# Altium schematic sheet power_PWR.schdoc: power_PWR.SchDoc
size A4; Organization: Badgerloop; Address1: 133 Engineering Research; Address2: Building; Address3: Madison, WI 53715; DocumentNumber: 1; Revision: A; SheetNumber: 1; SheetTotal: 2
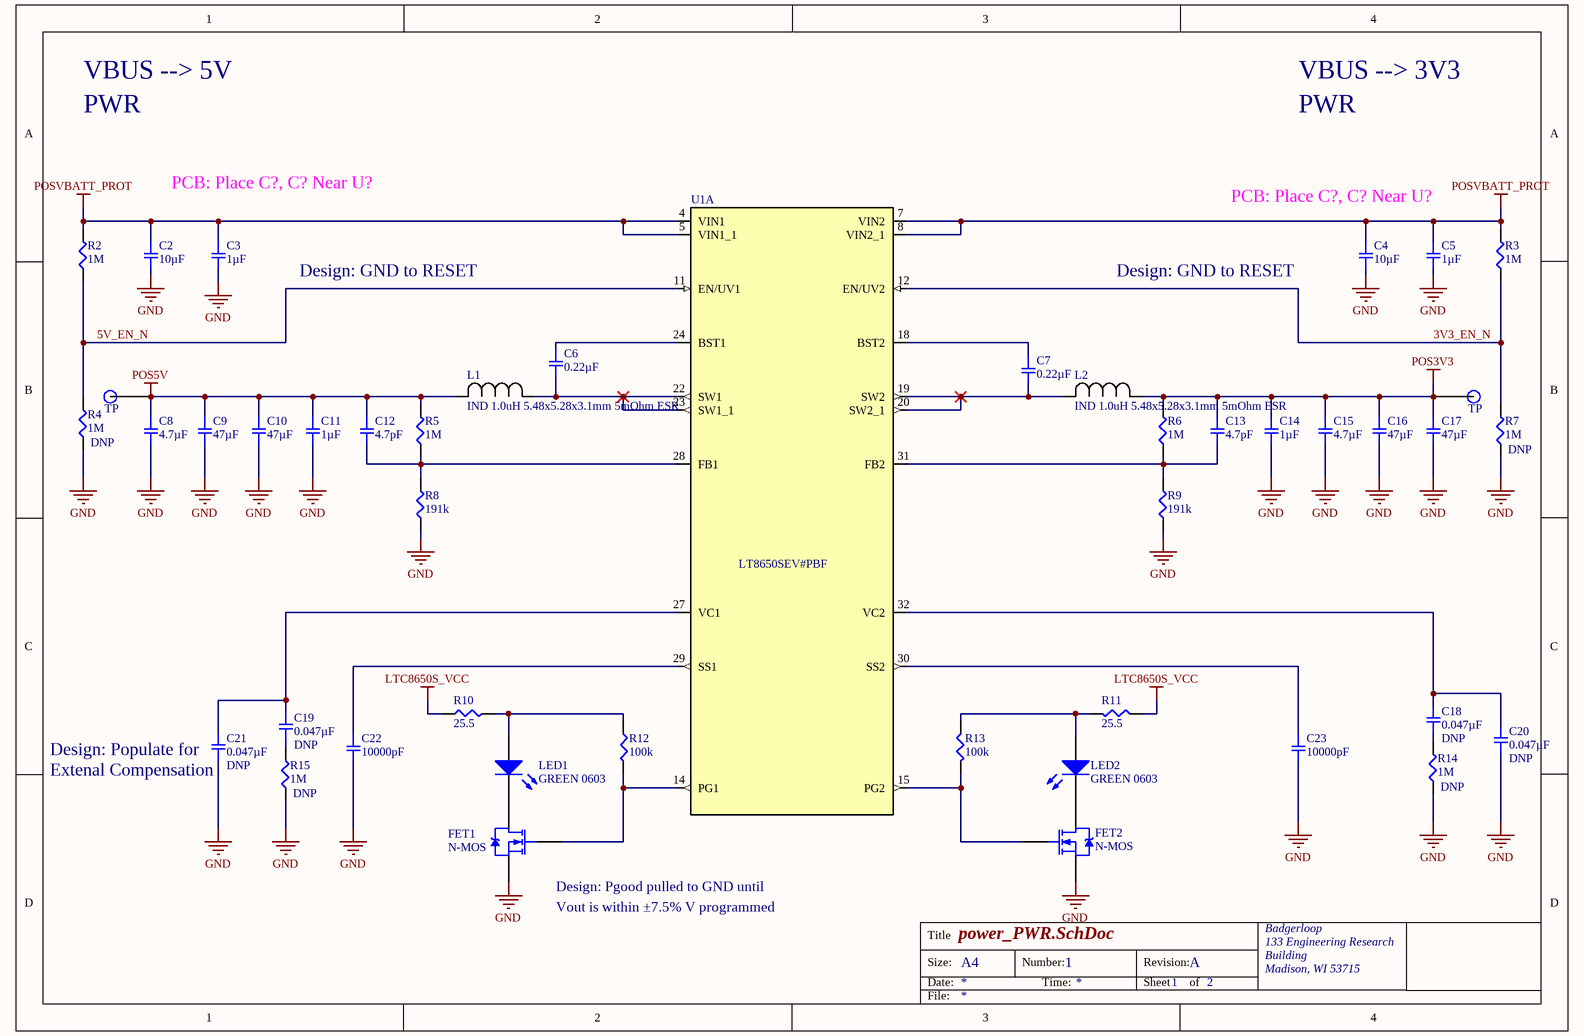
[diagram p0: power_PWR.schdoc]

## Parts
C2  10µF  [SMD-1206C]
C3  1µF  [SMD-0805C]
C4  10µF  [SMD-1206C]
C5  1µF  [SMD-0805C]
C6  0.22µF  [SMD-0603C]
C7  0.22µF  [SMD-0603C]
C8  4.7µF  [SMD-0603C]
C9  47µF  [SMD-1206C]
C10  47µF  [SMD-1206C]
C11  1µF  [SMD-0603C]
C12  4.7pF  [SMD-0603C]
C13  4.7pF  [SMD-0603C]
C14  1µF  [SMD-0603C]
C15  4.7µF  [SMD-0603C]
C16  47µF  [SMD-1206C]
C17  47µF  [SMD-1206C]
C18  0.047µF  Do Not Populate: DNP  [SMD-0402C]
C19  0.047µF  Do Not Populate: DNP  [SMD-0402C]
C20  0.047µF  Do Not Populate: DNP  [SMD-0402C]
C21  0.047µF  Do Not Populate: DNP  [SMD-0402C]
C22  10000pF  [SMD-0603C]
C23  10000pF  [SMD-0603C]
FET1  N-MOS  [SOT95P240X110-3N]
FET2  N-MOS  [SOT95P240X110-3N]
L1  IND 1.0uH 5.48x5.28x3.1mm 5mOhm ESR  [INDC5649X31N]
L2  IND 1.0uH 5.48x5.28x3.1mm 5mOhm ESR  [INDC5649X31N]
LED1  GREEN 0603  [LED 0603 GREEN]
LED2  GREEN 0603  [LED 0603 GREEN]
R2  1M  [SMD-0402-RES]
R3  1M  [SMD-0402-RES]
R4  1M  Do Not Populate: DNP  [SMD-0402-RES]
R5  1M  [SMD-0402-RES]
R6  1M  [SMD-0402-RES]
R7  1M  Do Not Populate: DNP  [SMD-0402-RES]
R8  191k  [SMD-0402-RES]
R9  191k  [SMD-0402-RES]
R10  25.5  [SMD-0805-RES]
R11  25.5  [SMD-0805-RES]
R12  100k  [SMD-0402-RES]
R13  100k  [SMD-0402-RES]
R14  1M  Do Not Populate: DNP  [SMD-0402-RES]
R15  1M  Do Not Populate: DNP  [SMD-0402-RES]
TP7  TP  [Test Point]
TP8  TP  [Test Point]
U1  LT8650SEV#PBF  [QFN50P600X400X103-32N240X440]  (part A of 2)

## Nets
GND: C2.2 C3.2 C4.2 C5.2 C8.2 C9.2 C10.2 C11.2 C14.2 C15.2 C16.2 C17.2 C20.1 C21.1 C22.2 C23.2 FET1.3(S) FET2.3(S) R4.1 R7.1 R8.1 R9.1 R14.1 R15.1
LTC8650S_VCC: R10.1 R11.1
POS3V3: C13.1 C14.1 C15.1 C16.1 C17.1 L2.1 R6.2 TP8.1
POS5V: C8.1 C9.1 C10.1 C11.1 C12.1 L1.2 R5.2 TP7.1
POSVBATT_PROT: C2.1 C3.1 C4.1 C5.1 R2.2 R3.2 U1.4(VIN1) U1.5(VIN1_1) U1.7(VIN2) U1.8(VIN2_1)
3V3_EN_N: R3.1 R7.2 U1.12(EN/UV2)
5V_EN_N: R2.1 R4.2 U1.11(EN/UV1)
NetC6_1: C6.1 U1.24(BST1)
NetC6_2: C6.2 L1.1 U1.22(SW1) U1.23(SW1_1)
NetC7_1: C7.1 U1.18(BST2)
NetC7_2: C7.2 L2.2 U1.19(SW2) U1.20(SW2_1)
NetC12_2: C12.2 R5.1 R8.2 U1.28(FB1)
NetC13_2: C13.2 R6.1 R9.2 U1.31(FB2)
NetC18_1: C18.1 R14.2
NetC18_2: C18.2 C20.2 U1.32(VC2)
NetC19_1: C19.1 R15.2
NetC19_2: C19.2 C21.2 U1.27(VC1)
NetC22_1: C22.1 U1.29(SS1)
NetC23_1: C23.1 U1.30(SS2)
NetFET1_1: FET1.1(G) R12.2 U1.14(PG1)
NetFET1_2: FET1.2(D) LED1.2(K)
NetFET2_1: FET2.1(G) R13.2 U1.15(PG2)
NetFET2_2: FET2.2(D) LED2.2(K)
NetLED1_1: LED1.1(A) R10.2 R12.1
NetLED2_1: LED2.1(A) R11.2 R13.1

## Notes on the sheet
- VBUS --> 5V
- PWR
- VBUS --> 3V3
- PCB: Place C?, C? Near U?
- Design: GND to RESET
- (near C21) Design: Populate for
- (near C21) Extenal Compensation
- (near FET1) Design: Pgood pulled to GND until
- (near FET1) Vout is within ±7.5% V programmed
- Title
- Size:
- Date:
- A4
- Number:
- Time:
- Revision:
- Sheet
- of
- File:

## Library data of the parts
C2 C4 = GRM31CR61H106KA12L: CAP CER 10UF 50V X5R 1206; Manufacturer: Murata Electronics North America; Factory Stock: 0; Unit Price (USD): 0.65; Minimum Quantity: 1; Tolerance: ±10%; Datasheets: http://www.murata.com/~/media/webrenewal/support/library/catalog/products/capacitor/mlcc/c02e.pdf; Image: //media.digikey.com/Renders/Murata%20Renders/GR331BD72E473KW01L.jpg; Digi-Key Part Number: 490-5961-1-ND; Part Number: GRM31CR61H106KA12L; Quantity Available: 86736; @ qty: 0; Packaging: Cut Tape (CT); Series: GRM; Part Status: Active; Value: 10µF; Voltage: 50V; Temperature Coefficient: X5R; Operating Temperature: -55°C ~ 85°C; Features: -; Ratings: -; Applications: General Purpose; Mounting Type: Surface Mount, MLCC; Package / Case: 1206 (3216 Metric); Size / Dimension: 0.126" L x 0.063" W (3.20mm x 1.60mm); Height - Seated (Max): -; Thickness (Max): 0.071" (1.80mm); Lead Spacing: -; Lead Style: -
C3 C5 = GCJ21BR71H105KA01L: CAP CER 1UF 50V X7R 0805; Manufacturer: Murata Electronics North America; Factory Stock: 0; Unit Price (USD): 0.33; Minimum Quantity: 1; Tolerance: ±10%; Datasheets: http://www.murata.com/~/media/webrenewal/support/library/catalog/products/capacitor/mlcc/c03e.ashx; Image: //media.digikey.com/Renders/Murata%20Renders/0805%20(2012%20Metric)%20.85mm.jpg; Digi-Key Part Number: 490-10667-1-ND; Part Number: GCJ21BR71H105KA01L; Quantity Available: 55137; @ qty: 0; Packaging: Cut Tape (CT); Series: GCJ; Part Status: Active; Value: 1µF; Voltage: 50V; Temperature Coefficient: X7R; Operating Temperature: -55°C ~ 125°C; Features: Soft Termination; Ratings: AEC-Q200; Applications: Automotive, Boardflex Sensitive; Mounting Type: Surface Mount, MLCC; Package / Case: 0805 (2012 Metric); Size / Dimension: 0.079" L x 0.049" W (2.00mm x 1.25mm); Height - Seated (Max): -; Thickness (Max): 0.057" (1.45mm); Lead Spacing: -; Lead Style: -
C6 C7 = GCJ188R71E224KA12D: CAP CER 0.22UF 25V X7R 0603; Manufacturer: Murata Electronics North America; Factory Stock: 0; Unit Price (USD): 0.24; Minimum Quantity: 1; Tolerance: ±10%; Datasheets: http://www.murata.com/~/media/webrenewal/support/library/catalog/products/capacitor/mlcc/c03e.ashx; Image: //media.digikey.com/Renders/Murata%20Renders/0603%28LQG18%29.jpg; Digi-Key Part Number: 490-5797-1-ND; Part Number: GCJ188R71E224KA12D; Quantity Available: 23903; @ qty: 0; Packaging: Cut Tape (CT); Series: GCJ; Part Status: Active; Value: 0.22µF; Voltage: 25V; Temperature Coefficient: X7R; Operating Temperature: -55°C ~ 125°C; Features: Soft Termination; Ratings: AEC-Q200; Applications: Automotive, Boardflex Sensitive; Mounting Type: Surface Mount, MLCC; Package / Case: 0603 (1608 Metric); Size / Dimension: 0.063" L x 0.031" W (1.60mm x 0.80mm); Height - Seated (Max): -; Thickness (Max): 0.035" (0.90mm); Lead Spacing: -; Lead Style: -
C8 C15 = GRM188R61E475KE11D: CAP CER 4.7UF 25V X5R 0603; Manufacturer: Murata Electronics North America; Factory Stock: 0; Unit Price (USD): 0.32; Minimum Quantity: 1; Tolerance: ±10%; Datasheets: http://www.murata.com/~/media/webrenewal/support/library/catalog/products/capacitor/mlcc/c02e.pdf; Image: //media.digikey.com/Renders/Murata%20Renders/ZRB-SERIES-0402.jpg; Digi-Key Part Number: 490-7203-1-ND; Part Number: GRM188R61E475KE11D; Quantity Available: 150881; @ qty: 0; Packaging: Cut Tape (CT); Series: GRM; Part Status: Active; Value: 4.7µF; Voltage: 25V; Temperature Coefficient: X5R; Operating Temperature: -55°C ~ 85°C; Features: -; Ratings: -; Applications: General Purpose; Mounting Type: Surface Mount, MLCC; Package / Case: 0603 (1608 Metric); Size / Dimension: 0.063" L x 0.031" W (1.60mm x 0.80mm); Height - Seated (Max): -; Thickness (Max): 0.031" (0.80mm); Lead Spacing: -; Lead Style: -
C9 C10 C16 C17 = GRM31CR61A476ME15L: CAP CER 47UF 10V X5R 1206; Manufacturer: Murata Electronics North America; Factory Stock: 0; Unit Price (USD): 0.64; Minimum Quantity: 1; Tolerance: ±20%; Datasheets: http://www.murata.com/~/media/webrenewal/support/library/catalog/products/capacitor/mlcc/c02e.pdf; Image: //media.digikey.com/Renders/Murata%20Renders/GR331BD72E473KW01L.jpg; Digi-Key Part Number: 490-5528-1-ND; Part Number: GRM31CR61A476ME15L; Quantity Available: 151940; @ qty: 0; Packaging: Cut Tape (CT); Series: GRM; Part Status: Active; Value: 47µF; Voltage: 10V; Temperature Coefficient: X5R; Operating Temperature: -55°C ~ 85°C; Features: -; Ratings: -; Applications: General Purpose; Mounting Type: Surface Mount, MLCC; Package / Case: 1206 (3216 Metric); Size / Dimension: 0.126" L x 0.063" W (3.20mm x 1.60mm); Height - Seated (Max): -; Thickness (Max): 0.071" (1.80mm); Lead Spacing: -; Lead Style: -
C11 C14 = GRM188R61H105KAALD: CAP CER 1UF 50V X5R 0603; Manufacturer: Murata Electronics North America; Factory Stock: 0; Unit Price (USD): 0.17; Minimum Quantity: 1; Tolerance: ±10%; Datasheets: http://www.murata.com/~/media/webrenewal/support/library/catalog/products/capacitor/mlcc/c02e.pdf; Image: //media.digikey.com/Renders/Murata%20Renders/ZRB-SERIES-0402.jpg; Digi-Key Part Number: 490-10732-1-ND; Part Number: GRM188R61H105KAALD; Quantity Available: 46576; @ qty: 0; Packaging: Cut Tape (CT); Series: GRM; Part Status: Active; Value: 1µF; Voltage: 50V; Temperature Coefficient: X5R; Operating Temperature: -55°C ~ 85°C; Features: -; Ratings: -; Applications: General Purpose; Mounting Type: Surface Mount, MLCC; Package / Case: 0603 (1608 Metric); Size / Dimension: 0.063" L x 0.031" W (1.60mm x 0.80mm); Height - Seated (Max): -; Thickness (Max): 0.035" (0.90mm); Lead Spacing: -; Lead Style: -
C12 C13 = GRM1885C1H4R7CA01D: CAP CER 4.7PF 50V NP0 0603; Manufacturer: Murata Electronics North America; Factory Stock: 0; Unit Price (USD): 0.1; Minimum Quantity: 1; Tolerance: ±0.25pF; Temperature Coefficient: C0G, NP0; Datasheets: http://www.murata.com/~/media/webrenewal/support/library/catalog/products/capacitor/mlcc/c02e.pdf; Image: //media.digikey.com/Renders/Murata%20Renders/ZRB-SERIES-0402.jpg; Digi-Key Part Number: 490-12722-1-ND; Part Number: GRM1885C1H4R7CA01D; Quantity Available: 25832; @ qty: 0; Packaging: Cut Tape (CT); Series: GRM; Part Status: Active; Value: 4.7pF; Voltage: 50V; Operating Temperature: -55°C ~ 125°C; Features: -; Ratings: -; Applications: General Purpose; Mounting Type: Surface Mount, MLCC; Package / Case: 0603 (1608 Metric); Size / Dimension: 0.063" L x 0.031" W (1.60mm x 0.80mm); Height - Seated (Max): -; Thickness (Max): 0.035" (0.90mm); Lead Spacing: -; Lead Style: -
C18-C21 = GCM155R71C473KA37D: CAP CER 0.047UF 16V X7R 0402; Manufacturer: Murata Electronics North America; Factory Stock: 0; Unit Price (USD): 0.1; Minimum Quantity: 1; Tolerance: ±10%; Datasheets: http://www.murata.com/~/media/webrenewal/support/library/catalog/products/capacitor/mlcc/c03e.ashx; Image: //media.digikey.com/Renders/Murata%20Renders/ZRB-SERIES-0402.jpg; Digi-Key Part Number: 490-6042-1-ND; Part Number: GCM155R71C473KA37D; Quantity Available: 86052; @ qty: 0; Packaging: Cut Tape (CT); Series: GCM; Part Status: Active; Value: 0.047µF; Voltage: 16V; Temperature Coefficient: X7R; Operating Temperature: -55°C ~ 125°C; Features: -; Ratings: AEC-Q200; Applications: Automotive; Mounting Type: Surface Mount, MLCC; Package / Case: 0402 (1005 Metric); Size / Dimension: 0.039" L x 0.020" W (1.00mm x 0.50mm); Height - Seated (Max): -; Thickness (Max): 0.022" (0.55mm); Lead Spacing: -; Lead Style: -
C22 C23 = GRM188R71E103KA01D: CAP CER 10000PF 25V X7R 0603; Manufacturer: Murata Electronics North America; Factory Stock: 0; Unit Price (USD): 0.1; Minimum Quantity: 1; Tolerance: ±10%; Datasheets: http://www.murata.com/~/media/webrenewal/support/library/catalog/products/capacitor/mlcc/c02e.pdf; Image: //media.digikey.com/Renders/Murata%20Renders/ZRB-SERIES-0402.jpg; Digi-Key Part Number: 490-1520-1-ND; Part Number: GRM188R71E103KA01D; Quantity Available: 886950; @ qty: 0; Packaging: Cut Tape (CT); Series: GRM; Part Status: Active; Value: 10000pF; Voltage: 25V; Temperature Coefficient: X7R; Operating Temperature: -55°C ~ 125°C; Features: -; Ratings: -; Applications: General Purpose; Mounting Type: Surface Mount, MLCC; Package / Case: 0603 (1608 Metric); Size / Dimension: 0.063" L x 0.031" W (1.60mm x 0.80mm); Height - Seated (Max): -; Thickness (Max): 0.035" (0.90mm); Lead Spacing: -; Lead Style: -
FET1 FET2 = N-MOS Enhancement Mode: MOSFET N-CH 60V 200MA SOT23-3; Manufacturer: Zetex; Manufacturer P/N: ZVN4106FTA; Digikey P/N: ZVN4106FCT-ND
L1 L2 = IND 1.0uH 5.48x5.28x3.1mm 5mOhm ESR: XFL5030-102ME; Vendor: CoilCraft; Type: DEV; Tolerance: +-20%; Maximum DC Current: 28A; Inductance: 1uH; Qualification: AEC-Q200; Manufacturer_Part_Number: XFL5030-102ME; RefDes: RefDes; Value: 1.0uH; Do Not Populate: *; Temperature: -40C ~ 125C; Package / Case: 5.48mm x 5.28mm x 3.1mm; Height: 3.1mm; Link: https://www.mouser.com/ProductDetail/Coilcraft/XFL5030-102MEB?qs=sGAEpiMZZMsg%252by3WlYCkUy0Se8nYOmwuY%252bO5URw9yeY%3d; Datasheet: https://www.mouser.com/datasheet/2/597/xfl5030-1223909.pdf
LED1 LED2 = LED GREEN 0603: Manufacturer: Lite-On Inc.; Manufacturer P/N: LTST-C190KGKT; Digikey P/N: 160-1435-1-ND; Package / Case: 0603; Color: GREEN
R2-R7 R14 R15 = ERJ-2RKF1004X: RES SMD 1M OHM 1% 1/10W 0402; Manufacturer: Panasonic Electronic Components; Factory Stock: 0; Unit Price (USD): 0.00496; @ qty: 1500; Minimum Quantity: 1; Power (Watts): 0.1W, 1/10W; Temperature Coefficient: ±100ppm/°C; Part Number: ERJ-2RKF1004X; Datasheets: http://industrial.panasonic.com/www-cgi/jvcr13pz.cgi?E+PZ+3+AOA0002+ERJ2RKF1004X+7+WW; Image: //media.digikey.com/Photos/Panasonic%20Photos/ERJ-PA2-Series.jpg; Digi-Key Part Number: P1.00MLCT-ND; Quantity Available: 773705; Packaging: Cut Tape (CT); Series: ERJ; Part Status: Active; Value: 1M; Tolerance: ±1%; Composition: Thick Film; Features: Automotive AEC-Q200; Operating Temperature: -55°C ~ 155°C; Package / Case: 0402 (1005 Metric); Supplier Device Package: 0402; Size / Dimension: 0.039" L x 0.020" W (1.00mm x 0.50mm); Height - Seated (Max): 0.016" (0.40mm); Number of Terminations: 2; Failure Rate: -
R8 R9 = ERJ-2RKF1913X: RES SMD 191K OHM 1% 1/10W 0402; Manufacturer: Panasonic Electronic Components; Factory Stock: 0; Unit Price (USD): 0.00496; @ qty: 1500; Minimum Quantity: 1; Power (Watts): 0.1W, 1/10W; Temperature Coefficient: ±100ppm/°C; Part Number: ERJ-2RKF1913X; Datasheets: http://industrial.panasonic.com/www-cgi/jvcr13pz.cgi?E+PZ+3+AOA0002+ERJ2RKF1913X+7+WW; Image: //media.digikey.com/Photos/Panasonic%20Photos/ERJ-PA2-Series.jpg; Digi-Key Part Number: P191KLCT-ND; Quantity Available: 44522; Packaging: Cut Tape (CT); Series: ERJ; Part Status: Active; Value: 191k; Tolerance: ±1%; Composition: Thick Film; Features: Automotive AEC-Q200; Operating Temperature: -55°C ~ 155°C; Package / Case: 0402 (1005 Metric); Supplier Device Package: 0402; Size / Dimension: 0.039" L x 0.020" W (1.00mm x 0.50mm); Height - Seated (Max): 0.016" (0.40mm); Number of Terminations: 2; Failure Rate: -
R10 R11 = ERJ-6ENF25R5V: RES SMD 25.5 OHM 1% 1/8W 0805; Manufacturer: Panasonic Electronic Components; Factory Stock: 0; Unit Price (USD): 0.00729; @ qty: 1500; Minimum Quantity: 1; Power (Watts): 0.125W, 1/8W; Temperature Coefficient: ±100ppm/°C; Part Number: ERJ-6ENF25R5V; Datasheets: http://industrial.panasonic.com/www-cgi/jvcr13pz.cgi?E+PZ+3+AOA0002+ERJ6ENF25R5V+7+WW; Image: //media.digikey.com/Renders/Panasonic%20Renders/ERJ-0805%20Pkg.jpg; Digi-Key Part Number: P25.5CCT-ND; Quantity Available: 41783; Packaging: Cut Tape (CT); Series: ERJ; Part Status: Active; Value: 25.5; Tolerance: ±1%; Composition: Thick Film; Features: Automotive AEC-Q200; Operating Temperature: -55°C ~ 155°C; Package / Case: 0805 (2012 Metric); Supplier Device Package: 0805; Size / Dimension: 0.079" L x 0.049" W (2.00mm x 1.25mm); Height - Seated (Max): 0.028" (0.70mm); Number of Terminations: 2; Failure Rate: -
R12 R13 = ERJ-2GEJ104X: RES SMD 100K OHM 5% 1/10W 0402; Manufacturer: Panasonic Electronic Components; Factory Stock: 0; Unit Price (USD): 0.00350; @ qty: 1500; Minimum Quantity: 1; Power (Watts): 0.1W, 1/10W; Temperature Coefficient: ±200ppm/°C; Part Number: ERJ-2GEJ104X; Datasheets: http://industrial.panasonic.com/www-cgi/jvcr13pz.cgi?E+PZ+3+AOA0001+ERJ2GEJ104X+7+WW; Image: //media.digikey.com/Photos/Panasonic%20Photos/ERJ-PA2-Series.jpg; Digi-Key Part Number: P100KJCT-ND; Quantity Available: 2387986; Packaging: Cut Tape (CT); Series: ERJ; Part Status: Active; Value: 100k; Tolerance: ±5%; Composition: Thick Film; Features: Automotive AEC-Q200; Operating Temperature: -55°C ~ 155°C; Package / Case: 0402 (1005 Metric); Supplier Device Package: 0402; Size / Dimension: 0.039" L x 0.020" W (1.00mm x 0.50mm); Height - Seated (Max): 0.016" (0.40mm); Number of Terminations: 2; Failure Rate: -
U1 = LT8650SEV#PBF: LT8650S - Dual Channel 4A, 42V, Synchronous Step-Down Silent Switcher 2 with 6.2ÂµA Quiescent Current; MF: Linear Technology; MP: LT8650SEV#PBF; SnapEDA_Link: https://www.snapeda.com/parts/LT8650SEV%23PBF/Linear%20Technology/Analog%20Devices/view-part/?ref=snap; Digi-Key_Part_Number: LT8650SEV#PBF-ND; Package: LQFN-32 Linear Technology; Digi-Key_Purchase_URL: https://www.digikey.com/product-detail/en/linear-technology-analog-devices/LT8650SEV-PBF/LT8650SEV-PBF-ND/7702365?utm_source=snapeda&utm_medium=aggregator&utm_campaign=symbol; Value: *